# Altium schematic sheet mic_array.schdoc
size 421 x 279 mm
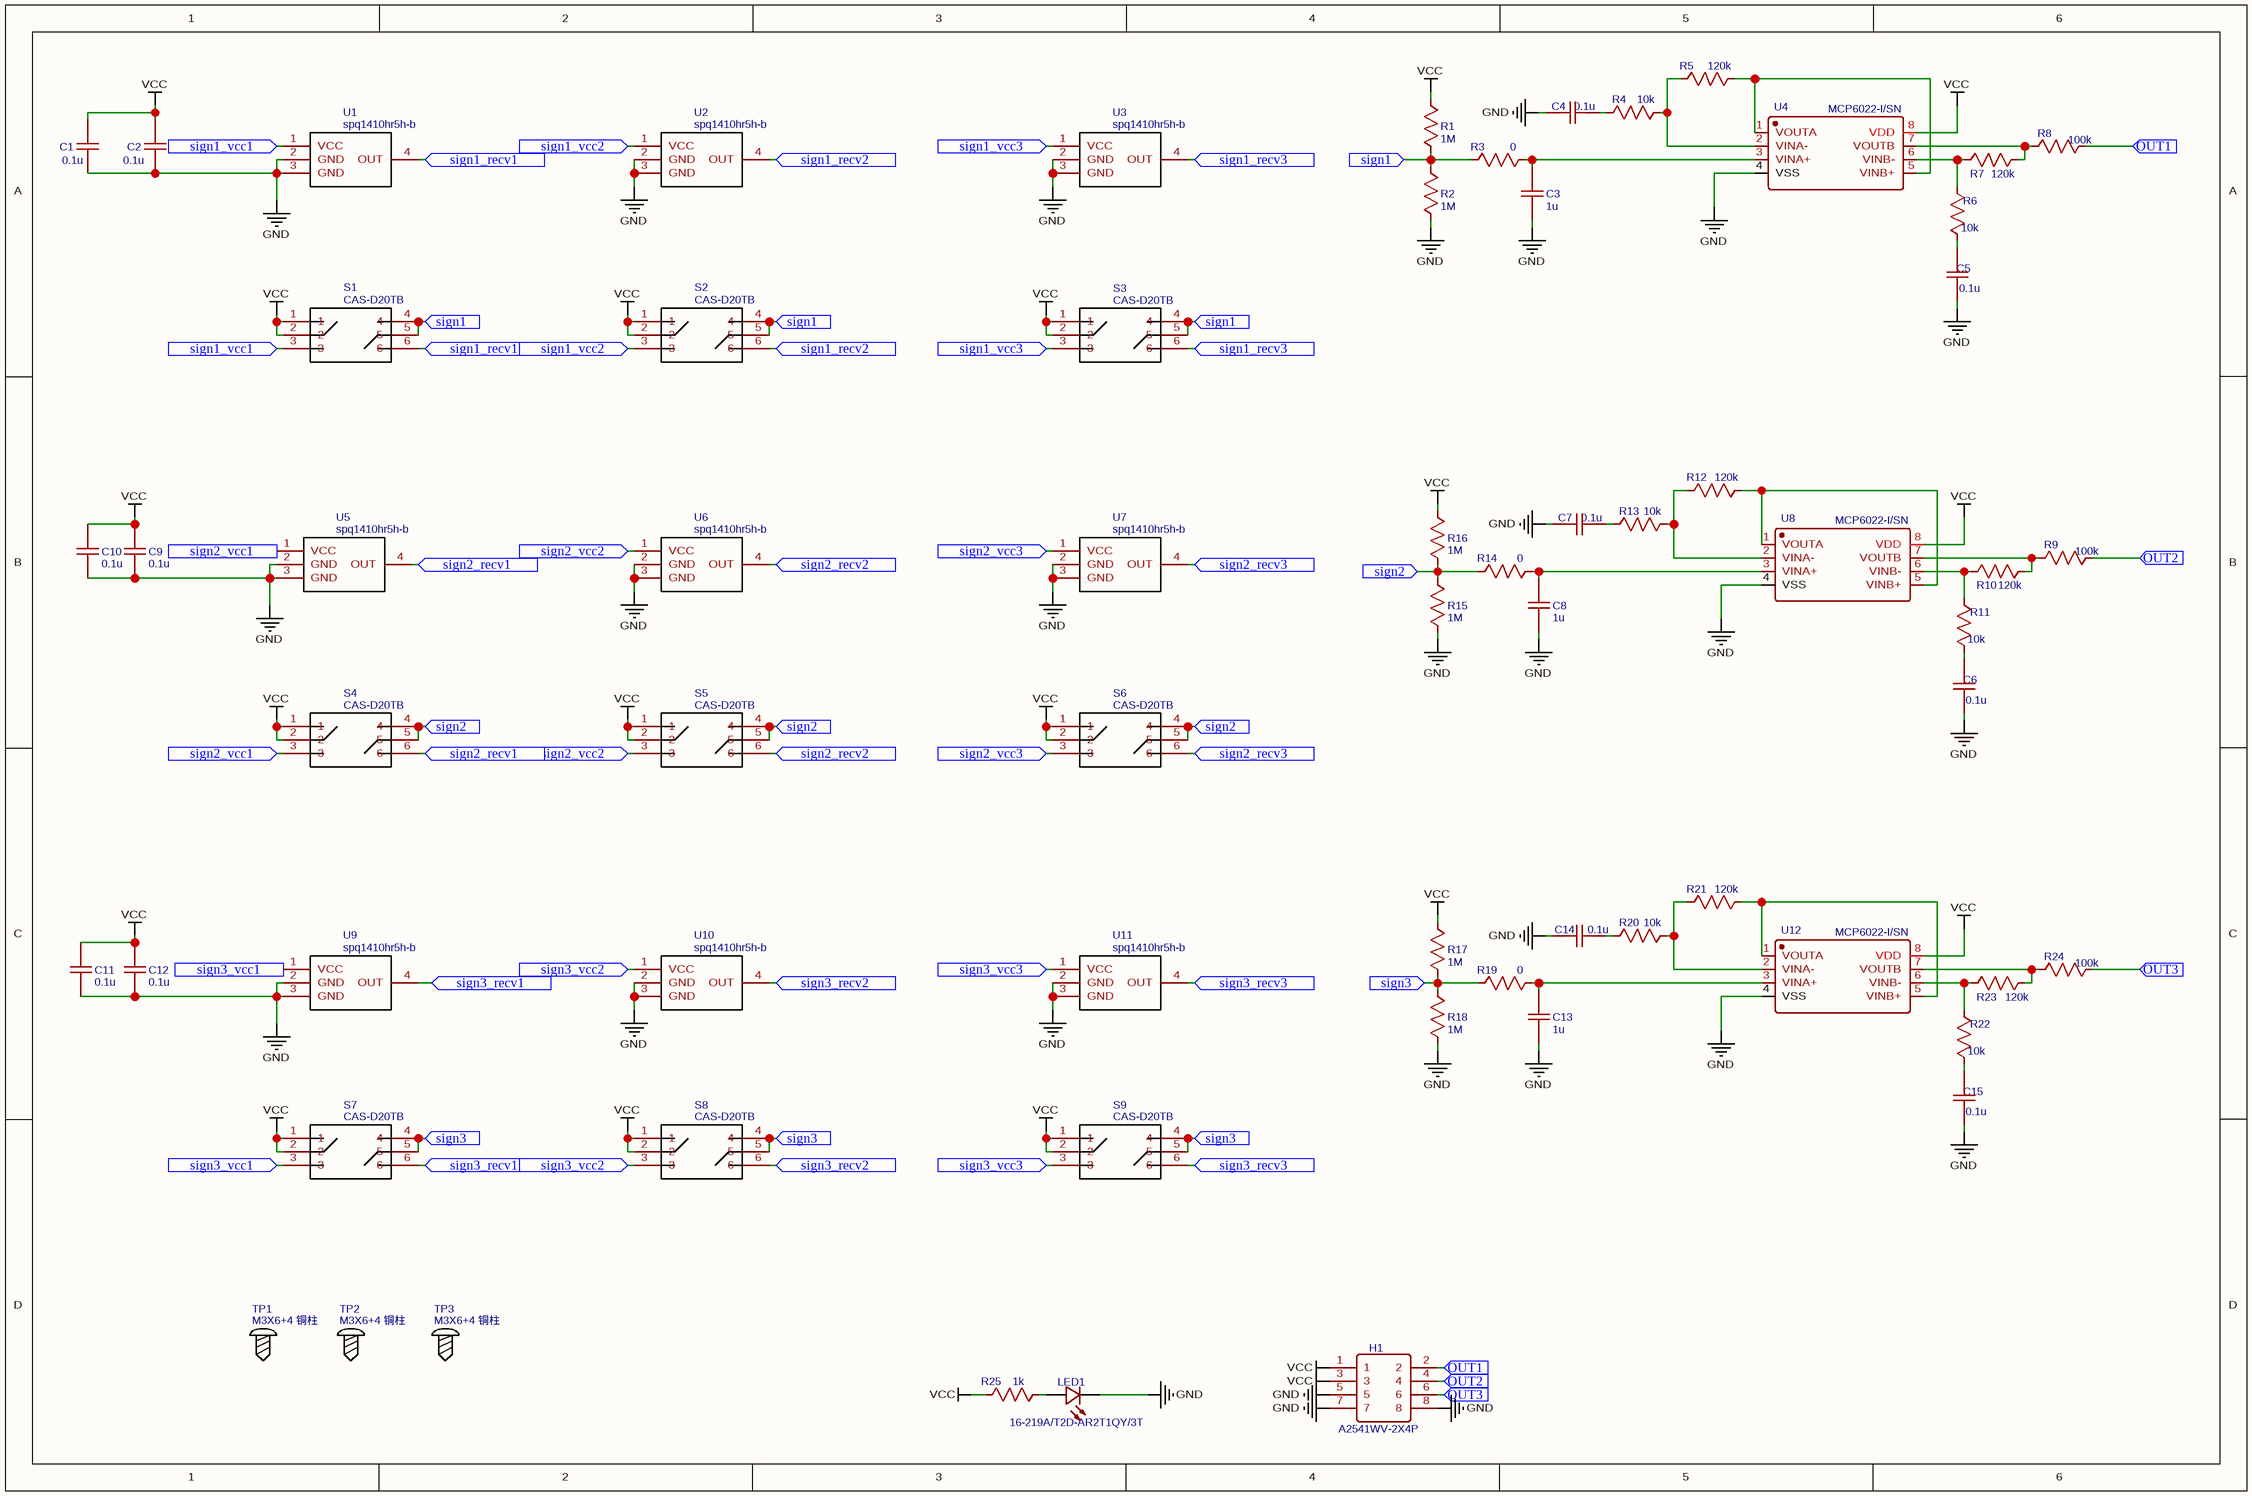
[diagram p0: mic_array.schdoc]

## Parts
C1  0.1u  [C0402]
C2  0.1u  [C0402]
C3  1u  [C0402]
C4  0.1u  [C0402]
C5  0.1u  [C0402]
C6  0.1u  [C0402]
C7  0.1u  [C0402]
C8  1u  [C0402]
C9  0.1u  [C0402]
C10  0.1u  [C0402]
C11  0.1u  [C0402]
C12  0.1u  [C0402]
C13  1u  [C0402]
C14  0.1u  [C0402]
C15  0.1u  [C0402]
H1  A2541WV-2X4P  [HDR-TH_8P-P2.54-V-R2-C4-S2.54_A2541WV-2X4P]
LED1  16-219A/T2D-AR2T1QY/3T  [LED0402-RD]
R1  1M  [R0402]
R2  1M  [R0402]
R3  0  [R0402]
R4  10k  [R0402]
R5  120k  [R0402]
R6  10k  [R0402]
R7  120k  [R0402]
R8  100k  [R0402]
R9  100k  [R0402]
R10  120k  [R0402]
R11  10k  [R0402]
R12  120k  [R0402]
R13  10k  [R0402]
R14  0  [R0402]
R15  1M  [R0402]
R16  1M  [R0402]
R17  1M  [R0402]
R18  1M  [R0402]
R19  0  [R0402]
R20  10k  [R0402]
R21  120k  [R0402]
R22  10k  [R0402]
R23  120k  [R0402]
R24  100k  [R0402]
R25  1k  [R0402]
S1  CAS-D20TB  [CAS-D20TB]
S2  CAS-D20TB  [CAS-D20TB]
S3  CAS-D20TB  [CAS-D20TB]
S4  CAS-D20TB  [CAS-D20TB]
S5  CAS-D20TB  [CAS-D20TB]
S6  CAS-D20TB  [CAS-D20TB]
S7  CAS-D20TB  [CAS-D20TB]
S8  CAS-D20TB  [CAS-D20TB]
S9  CAS-D20TB  [CAS-D20TB]
TP1  M3X6+4 铜柱  [M3铜柱]
TP2  M3X6+4 铜柱  [M3铜柱]
TP3  M3X6+4 铜柱  [M3铜柱]
U1  spq1410hr5h-b  [SPQ1410HR5H-B]
U2  spq1410hr5h-b  [SPQ1410HR5H-B]
U3  spq1410hr5h-b  [SPQ1410HR5H-B]
U4  MCP6022-I/SN  [SOIC-8_L4.9-W3.9-P1.27-LS6.0-BL]
U5  spq1410hr5h-b  [SPQ1410HR5H-B]
U6  spq1410hr5h-b  [SPQ1410HR5H-B]
U7  spq1410hr5h-b  [SPQ1410HR5H-B]
U8  MCP6022-I/SN  [SOIC-8_L4.9-W3.9-P1.27-LS6.0-BL]
U9  spq1410hr5h-b  [SPQ1410HR5H-B]
U10  spq1410hr5h-b  [SPQ1410HR5H-B]
U11  spq1410hr5h-b  [SPQ1410HR5H-B]
U12  MCP6022-I/SN  [SOIC-8_L4.9-W3.9-P1.27-LS6.0-BL]

## Ports
OUT1 (in), OUT2 (in), OUT3 (in), sign1 (in), sign1_recv1 (in), sign1_recv2 (in), sign1_recv3 (in), sign1_vcc1 (in), sign1_vcc2 (in), sign1_vcc3 (in), sign2 (in), sign2_recv1 (in), sign2_recv2 (in), sign2_recv3 (in), sign2_vcc1 (in), sign2_vcc2 (in), sign2_vcc3 (in), sign3 (in), sign3_recv1 (in), sign3_recv2 (in), sign3_recv3 (in), sign3_vcc1 (in), sign3_vcc2 (in), sign3_vcc3 (in)

## Nets
GND: C1.1 C2.1 C3.1 C4.2 C5.1 C6.1 C7.2 C8.1 C9.1 C10.1 C11.1 C12.1 C13.1 C14.2 C15.1 H1.5 H1.7 H1.8 LED1.1(-) R2.1 R15.1 R18.1 U1.2(GND) U1.3(GND) U2.2(GND) U2.3(GND) U3.2(GND) U3.3(GND) U4.4(VSS) U5.2(GND) U5.3(GND) U6.2(GND) U6.3(GND) U7.2(GND) U7.3(GND) U8.4(VSS) U9.2(GND) U9.3(GND) U10.2(GND) U10.3(GND) U11.2(GND) U11.3(GND) U12.4(VSS)
VCC: C1.2 C2.2 C9.2 C10.2 C11.2 C12.2 H1.1 H1.3 R1.2 R16.2 R17.2 R25.1 S1.1 S1.2 S2.1 S2.2 S3.1 S3.2 S4.1 S4.2 S5.1 S5.2 S6.1 S6.2 S7.1 S7.2 S8.1 S8.2 S9.1 S9.2 U4.8(VDD) U8.8(VDD) U12.8(VDD)
OUT1: H1.2 R8.1 ; port OUT1
OUT2: H1.4 R9.1 ; port OUT2
OUT3: H1.6 R24.1 ; port OUT3
sign1: R1.1 R2.2 R3.2 S1.4 S1.5 S2.4 S2.5 S3.4 S3.5 ; port sign1
sign1_recv1: S1.6 U1.4(OUT) ; port sign1_recv1
sign1_recv2: S2.6 U2.4(OUT) ; port sign1_recv2
sign1_recv3: S3.6 U3.4(OUT) ; port sign1_recv3
sign1_vcc1: S1.3 U1.1(VCC) ; port sign1_vcc1
sign1_vcc2: S2.3 U2.1(VCC) ; port sign1_vcc2
sign1_vcc3: S3.3 U3.1(VCC) ; port sign1_vcc3
sign2: R14.2 R15.2 R16.1 S4.4 S4.5 S5.4 S5.5 S6.4 S6.5 ; port sign2
sign2_recv1: S4.6 U5.4(OUT) ; port sign2_recv1
sign2_recv2: S5.6 U6.4(OUT) ; port sign2_recv2
sign2_recv3: S6.6 U7.4(OUT) ; port sign2_recv3
sign2_vcc1: S4.3 U5.1(VCC) ; port sign2_vcc1
sign2_vcc2: S5.3 U6.1(VCC) ; port sign2_vcc2
sign2_vcc3: S6.3 U7.1(VCC) ; port sign2_vcc3
sign3: R17.1 R18.2 R19.2 S7.4 S7.5 S8.4 S8.5 S9.4 S9.5 ; port sign3
sign3_recv1: S7.6 U9.4(OUT) ; port sign3_recv1
sign3_recv2: S8.6 U10.4(OUT) ; port sign3_recv2
sign3_recv3: S9.6 U11.4(OUT) ; port sign3_recv3
sign3_vcc1: S7.3 U9.1(VCC) ; port sign3_vcc1
sign3_vcc2: S8.3 U10.1(VCC) ; port sign3_vcc2
sign3_vcc3: S9.3 U11.1(VCC) ; port sign3_vcc3
NetC3_2: C3.2 R3.1 U4.3(VINA+)
NetC4_1: C4.1 R4.2
NetC5_2: C5.2 R6.1
NetC6_2: C6.2 R11.1
NetC7_1: C7.1 R13.2
NetC8_2: C8.2 R14.1 U8.3(VINA+)
NetC13_2: C13.2 R19.1 U12.3(VINA+)
NetC14_1: C14.1 R20.2
NetC15_2: C15.2 R22.1
NetLED1_2: LED1.2(+) R25.2
NetR4_1: R4.1 R5.2 U4.2(VINA-)
NetR5_1: R5.1 U4.1(VOUTA) U4.5(VINB+)
NetR6_2: R6.2 R7.2 U4.6(VINB-)
NetR7_1: R7.1 R8.2 U4.7(VOUTB)
NetR9_2: R9.2 R10.1 U8.7(VOUTB)
NetR10_2: R10.2 R11.2 U8.6(VINB-)
NetR12_1: R12.1 U8.1(VOUTA) U8.5(VINB+)
NetR12_2: R12.2 R13.1 U8.2(VINA-)
NetR20_1: R20.1 R21.2 U12.2(VINA-)
NetR21_1: R21.1 U12.1(VOUTA) U12.5(VINB+)
NetR22_2: R22.2 R23.2 U12.6(VINB-)
NetR23_1: R23.1 R24.2 U12.7(VOUTB)

## Library data of the parts
C1 C2 C4-C7 C9-C12 C14 C15 = 0.1u: nameAlias: Value(F); Contributor: LCEDA_Lib; spicePre: C; spiceSymbolName: C_0402_US
C3 C8 C13 = 1u: nameAlias: Value(F); Contributor: LCEDA_Lib; spicePre: C; spiceSymbolName: C_0402_US
H1 = A2541WV-2X4P: BOM_Manufacturer: Changjiang Connectors; Contributor: LCSC; BOM_Supplier: LCSC; BOM_Supplier Part: C225519; BOM_Manufacturer Part: A2541WV-2x4P; BOM_JLCPCB Part Class: Extended Part; spicePre: H; spiceSymbolName: A2541WV-2X4P
LED1 = 16-219A/T2D-AR2T1QY/3T: BOM_Manufacturer: EVERLIGHT; BOM_Supplier: LCSC; BOM_Manufacturer Part: 16-219A/T2D-AR2T1QY/3T; BOM_Supplier Part: C74342; BOM_JLCPCB Part Class: Extended Part; spicePre: L; spiceSymbolName: 16-219A/T2D-AR2T1QY/3T
R1 R2 R15-R18 = 1M: nameAlias: Value(Ω); Contributor: LCEDA_Lib; spicePre: R; spiceSymbolName: R_0402_US
R3 R14 R19 = 0: nameAlias: Value(Ω); Contributor: LCEDA_Lib; spicePre: R; spiceSymbolName: R_0402_US
R4 R6 R11 R13 R20 R22 = 10k: nameAlias: Value(Ω); Contributor: LCEDA_Lib; spicePre: R; spiceSymbolName: R_0402_US
R5 R7 R10 R12 R21 R23 = 120k: nameAlias: Value(Ω); Contributor: LCEDA_Lib; spicePre: R; spiceSymbolName: R_0402_US
R8 R9 R24 = 100k: nameAlias: Value(Ω); Contributor: LCEDA_Lib; spicePre: R; spiceSymbolName: R_0402_US
R25 = 1k: nameAlias: Value(Ω); Contributor: LCEDA_Lib; spicePre: R; spiceSymbolName: R_0402_US
S1-S9 = CAS-D20TB: BOM_Manufacturer: NIDEC; Contributor: iceeeewoo; spicePre: S; spiceSymbolName: CAS-D20TB
TP1-TP3 = M3X6+4 铜柱: Contributor: eda2022; BOM_Supplier Part: C551320; spicePre: T; spiceSymbolName: M3X6+4 铜柱
U1-U3 U5-U7 U9-U11 = spq1410hr5h-b: BOM_Manufacturer: KNOWLES; Contributor: Iceeeewoo; BOM_Supplier: knowles; spicePre: U; spiceSymbolName: spq1410hr5h-b
U4 U8 U12 = MCP6022-I/SN: BOM_Manufacturer: MICROCHIP; BOM_Supplier: LCSC; BOM_Manufacturer Part: MCP6022-I/SN; BOM_Supplier Part: C34047; BOM_JLCPCB Part Class: Extended Part; spicePre: U; spiceSymbolName: MCP6022-I/SN